# EAGLE schematic colororgan (EAGLE 7.1.0)
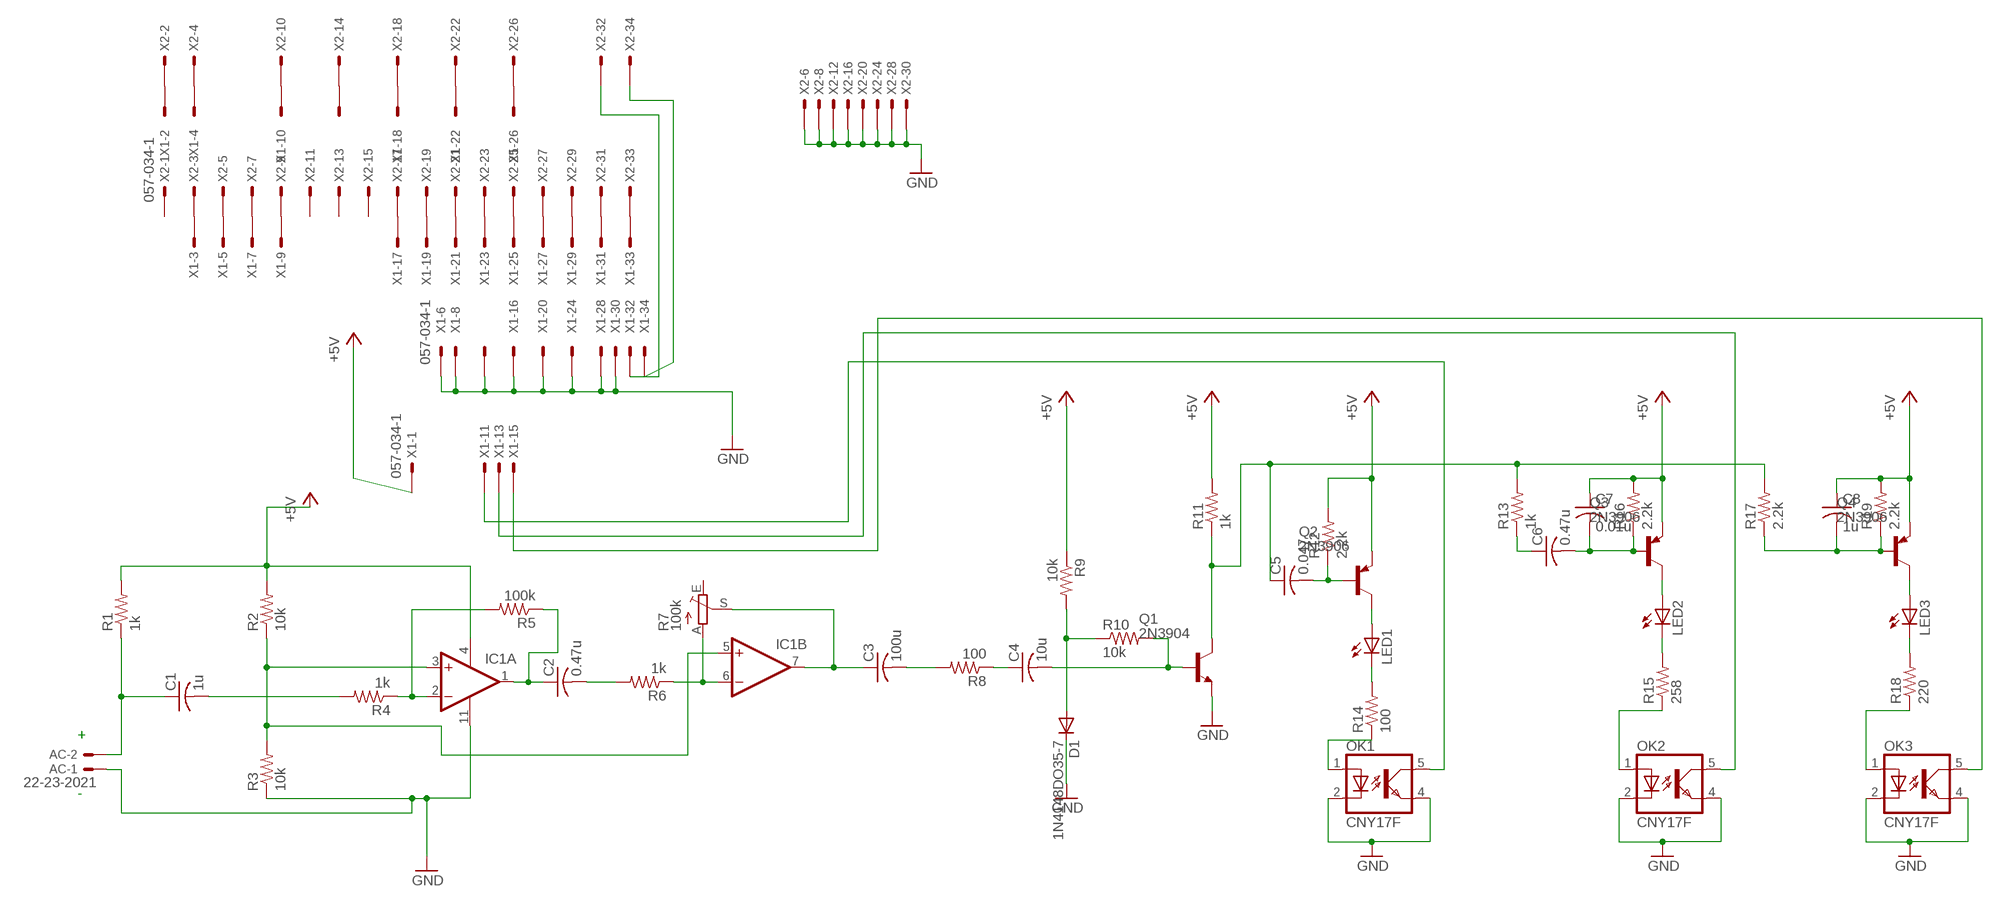
[diagram p0: schematic, sheet 1]

## Parts
AC  22-23-2021  [22-23-2021]
C1  1u  C-US025-050X050  [C025-050X050]
C2  0.47u  C-US025-050X050  [C025-050X050]
C3  100u  C-US025-050X050  [C025-050X050]
C4  10u  C-US025-050X050  [C025-050X050]
C5  0.047  C-US025-050X050  [C025-050X050]
C6  0.47u  C-US025-050X050  [C025-050X050]
C7  0.01u  C-US025-050X050  [C025-050X050]
C8  1u  C-US025-050X050  [C025-050X050]
D1  1N4148DO35-7  [DO35-7]
IC1  LMV324THR  [DIL14]
LED1  LED3MM  [LED3MM]
LED2  LED3MM  [LED3MM]
LED3  LED3MM  [LED3MM]
OK1  CNY17F  [DIL06]
OK2  CNY17F  [DIL06]
OK3  CNY17F  [DIL06]
Q1  2N3904  [TO92]
Q2  2N3906  [TO92]
Q3  2N3906  [TO92]
Q4  2N3906  [TO92]
R1  1k  R-US_0207/10  [0207/10]
R2  10k  R-US_0207/10  [0207/10]
R3  10k  R-US_0207/10  [0207/10]
R4  1k  R-US_0207/10  [0207/10]
R5  100k  R-US_0207/10  [0207/10]
R6  1k  R-US_0207/10  [0207/10]
R7  100k  TRIM_EU-RS3  [RS3]
R8  100  R-US_0207/10  [0207/10]
R9  10k  R-US_0207/10  [0207/10]
R10  10k  R-US_0207/10  [0207/10]
R11  1k  R-US_0207/10  [0207/10]
R12  2.2k  R-US_0207/10  [0207/10]
R13  1k  R-US_0207/10  [0207/10]
R14  100  R-US_0207/10  [0207/10]
R15  258  R-US_0207/10  [0207/10]
R16  2.2k  R-US_0207/10  [0207/10]
R17  2.2k  R-US_0207/10  [0207/10]
R18  220  R-US_0207/10  [0207/10]
R19  2.2k  R-US_0207/10  [0207/10]
X1  057-034-1  [057-034-1]
X2  057-034-1  [057-034-1]

## Nets
+5V [power]: C7.1 C8.1 IC1.4(P:V+) Q2.3(E) Q3.3(E) Q4.3(E) R1.2 R2.2 R9.1 R11.2 R12.2 R16.2 R19.2 X1.1
GND [power]: AC.1 D1.C IC1.11(P:V-) OK1.2(C) OK1.4(EMIT) OK2.2(C) OK2.4(EMIT) OK3.2(C) OK3.4(EMIT) Q1.3(E) R3.1 X1.6 X1.8 X1.12 X1.16 X1.20 X1.24 X1.28 X1.30 X2.6 X2.8 X2.12 X2.16 X2.20 X2.24 X2.28 X2.30
N$1: AC.2 C1.1 R1.1
N$2: D1.A R9.2 R10.1
N$3: C1.2 R4.2
N$4: IC1.3(A:+IN) IC1.5(B:+IN) R2.1 R3.2
N$5: IC1.2(A:-IN) R4.1 R5.2
N$6: C2.1 IC1.1(A:OUT) R5.1
N$7: C2.2 R6.2
N$8: IC1.6(B:-IN) R6.1 R7.A
N$9: C4.2 Q1.2(B) R10.2
N$10: C3.1 IC1.7(B:OUT) R7.S
N$11: C3.2 R8.2
N$12: C4.1 R8.1
N$13: C5.1 Q1.1(C) R11.1 R13.2 R17.2
N$14: C5.2 Q2.2(B) R12.1
N$15: OK1.1(A) R14.1
N$16: LED1.K(C) R14.2
N$17: LED1.A Q2.1(C)
N$18: C6.1 R13.1
N$19: C6.2 C7.2 Q3.2(B) R16.1
N$20: OK1.5(COL) X1.11
N$21: LED2.A Q3.1(C)
N$22: LED2.K(C) R15.2
N$23: OK2.1(A) R15.1
N$24: OK2.5(COL) X1.13
N$25: C8.2 Q4.2(B) R17.1 R19.1
N$26: LED3.A Q4.1(C)
N$27: LED3.K(C) R18.2
N$28: OK3.1(A) R18.1
N$29: OK3.5(COL) X1.15
N$30: X1.34 X2.34
N$31: X1.32 X2.32
N$32: X1.2 X2.2
N$35: X1.4 X2.4
N$36: X1.10 X2.10
N$37: X1.14 X2.14
N$38: X1.33 X2.33
N$39: X1.3 X2.3
N$40: X1.5 X2.5
N$41: X1.7 X2.7
N$42: X1.9 X2.9
N$43: X1.17 X2.17
N$44: X1.19 X2.19
N$45: X1.21 X2.21
N$46: X1.23 X2.23
N$47: X1.25 X2.25
N$48: X1.27 X2.27
N$49: X1.29 X2.29
N$50: X1.31 X2.31
N$51: X1.18 X2.18
N$52: X1.22 X2.22
N$53: X1.26 X2.26
Unconnected: IC1.8(C:OUT) IC1.9(C:-IN) IC1.10(C:+IN) IC1.12(D:+IN) IC1.13(D:-IN) IC1.14(D:OUT) R7.E X2.1 X2.11 X2.13 X2.15

## Notes on the sheet
- +
- -

## Library data of the parts
AC = con-molex:22-23-2021: .100" (2.54mm) Center Header - 2 Pin; MF: MOLEX; MPN: 22-23-2021; OC_FARNELL: 1462926; OC_NEWARK: 25C3832
C1-C8 = resistor:C-US: CAPACITOR, American symbol
D1 = diode:1N4148: DIODE high speed (Philips)
IC1 = linear:LMV324?*: Quad General Purpose, Low Voltage, Rail-to-Rail Output Operational Amplifiers Source: http://www.national.com/mpf/LM/LMV321.html http://www.national.com/dt/lmv_qual.pdf
LED1-LED3 = led:LED: LED OSRAM: - CHIPLED LG R971, LG N971, LY N971, LG Q971, LY Q971, LO R971, LY R971 LH N974, LH R974 LS Q976, LO Q976, LY Q976 LO Q996 - Hyper CHIPLED LW Q18S LB Q993, LB Q99A, LB R99A - SideLED LS A670, LO A670, LY A670, LG A670, LP A670 LB A673, LV A673, LT A673, LW A673 LH A674 LY A675 LS A676, LA A676, LO A676, LY A676, LW A676 LS A679, LY A679, LG A679 - Hyper Micro SIDELED® LS Y876, LA Y876, LO Y876, LY Y876 LT Y87S - SmartLED LW L88C, LW L88S LB L89C, LB L89S, LG L890 LS L89K, LO L89K, LY L89K LS L896, LA L896, LO L896, LY L896 - TOPLED LS T670, LO T670, LY T670, LG T670, LP T670 LSG T670, LSP T670, LSY T670, LOP T670, LYG T670 LG T671, LOG T671, LSG T671 LB T673, LV T673, LT T673, LW T673 LH T674 LS T676, LA T676, LO T676, LY T676, LB T676, LH T676, LSB T676, LW T676 LB T67C, LV T67C, LT T67C, LS T67K, LO T67K, LY T67K, LW E67C LS E67B, LA E67B, LO E67B, LY E67B, LB E67C, LV E67C, LT E67C LW T67C LS T679, LY T679, LG T679 LS T770, LO T770, LY T770, LG T770, LP T770 LB T773, LV T773, LT T773, LW T773 LH T774 LS E675, LA E675, LY E675, LS T675 LS T776, LA T776, LO T776, LY T776, LB T776 LHGB T686 LT T68C, LB T68C - Hyper Mini TOPLED® LB M676 - Mini TOPLED Santana® LG M470 LS M47K, LO M47K, LY M47K Source: http://www.osram.convergy.de LUXEON: - LUMILED® LXK2-PW12-R00, LXK2-PW12-S00, LXK2-PW14-U00, LXK2-PW14-V00 LXK2-PM12-R00, LXK2-PM12-S00, LXK2-PM14-U00 LXK2-PE12-Q00, LXK2-PE12-R00, LXK2-PE12-S00, LXK2-PE14-T00, LXK2-PE14-U00 LXK2-PB12-K00, LXK2-PB12-L00, LXK2-PB12-M00, LXK2-PB14-N00, LXK2-PB14-P00, LXK2-PB14-Q00 LXK2-PR12-L00, LXK2-PR12-M00, LXK2-PR14-Q00, LXK2-PR14-R00 LXK2-PD12-Q00, LXK2-PD12-R00, LXK2-PD12-S00 LXK2-PH12-R00, LXK2-PH12-S00 LXK2-PL12-P00, LXK2-PL12-Q00, LXK2-PL12-R00 Source: www.luxeon.com KINGBRIGHT: KA-3528ASYC Source: www.kingbright.com
OK1-OK3 = optocoupler:CNY17F: SIEMENS OPTO COUPLER; MF: VISHAY/TELEFUNKEN; MPN: CNY17F-3; OC_FARNELL: 1469473; OC_NEWARK: 58K0172
Q1 = transistor-npn:2N3904: NPN Transistor
Q2-Q4 = transistor-pnp:2N3906: PNP Transistor
R1-R6 R8-R19 = resistor:R-US_: RESISTOR, American symbol
R7 = pot:TRIM_EU-: POTENTIOMETER
X1 X2 = con-panduit:057-034-: CONNECTOR 34-pin series 057 contact pc board low profile headers; OC_FARNELL: unknown; OC_NEWARK: unknown

## Net classes
0 default: width 0.406 mm
1 power: width 0.61 mm